# Altium project IndoorLocalizationUnit.PrjPcb
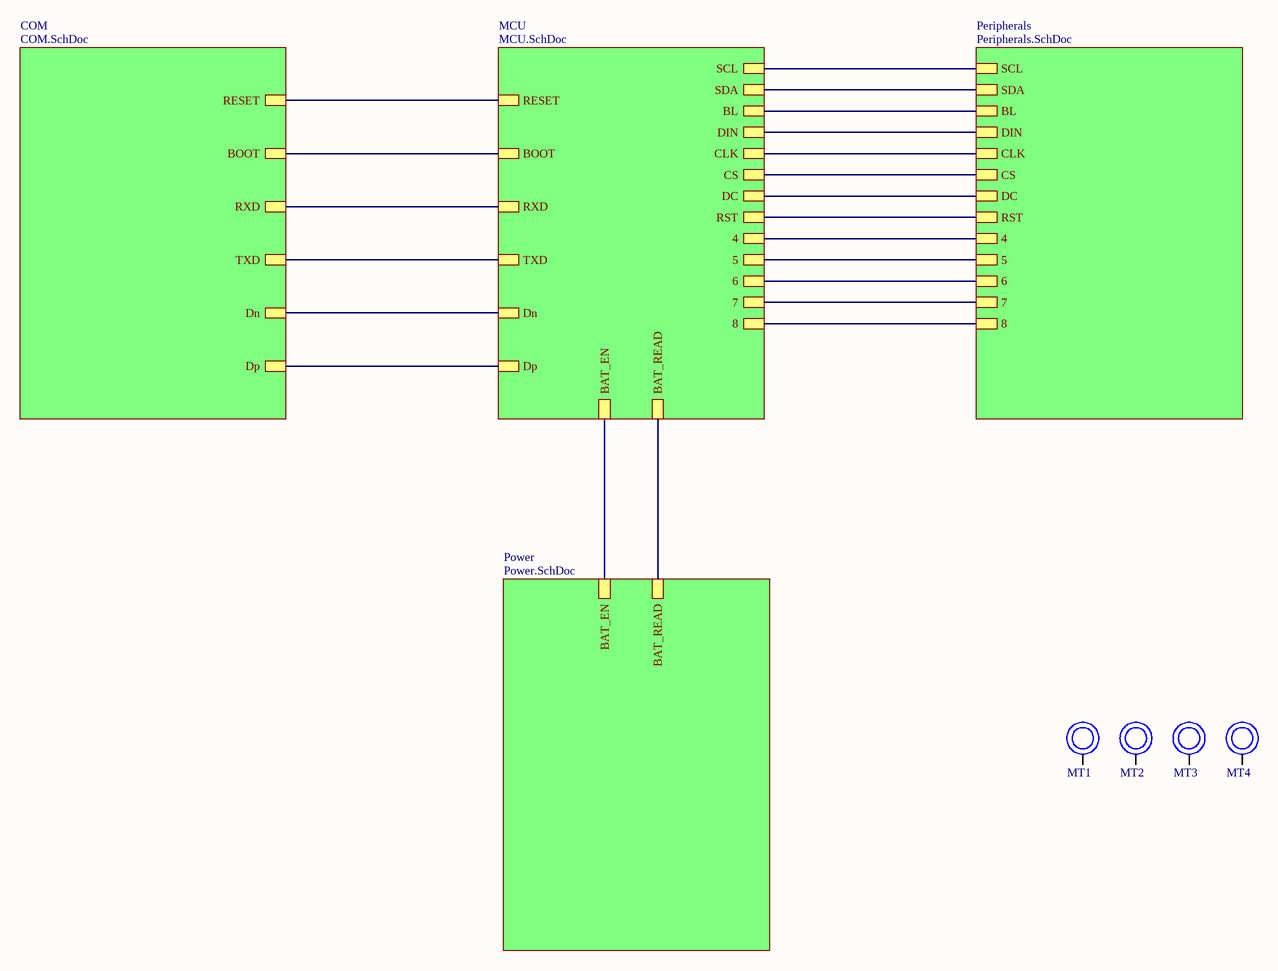
[diagram p0: Main.SchDoc]
5 sheets, 75 parts. Net scope: hierarchical (ports join the sheet entries above them; power ports are global).
Board file: PCB5.PcbDoc
Sheets:
  Main.SchDoc
    MCU = MCU.SchDoc
    Power = Power.SchDoc
    Peripherals = Peripherals.SchDoc
    COM = COM.SchDoc

## Sheet Main.SchDoc
size A3; SheetNumber: 1; SheetTotal: 5

### Parts
MT1  Mounting  [Mounting]  (value not drawn)
MT2  Mounting  [Mounting]  (value not drawn)
MT3  Mounting  [Mounting]  (value not drawn)
MT4  Mounting  [Mounting]  (value not drawn)

### Sub-sheets
COM = COM.SchDoc: RXD, TXD, Dn, Dp, BOOT, RESET
MCU = MCU.SchDoc: TXD, RXD, DC, RST, CS, SCL, SDA, BL, DIN, CLK, BAT_EN, BAT_READ, Dn, Dp, 7, 4, 6, 8, 5, RESET, BOOT
Peripherals = Peripherals.SchDoc: SCL, SDA, BL, DIN, CLK, CS, DC, RST, 4, 8, 5, 7, 6
Power = Power.SchDoc: BAT_EN, BAT_READ

### Nets
B_n: sheet MCU/Dp, sheet COM/Dp
B_p: sheet MCU/Dn, sheet COM/Dn
NetC3_B: sheet MCU/RESET, sheet COM/RESET
NetC5_A: sheet MCU/BOOT, sheet COM/BOOT
NetC11_B: sheet MCU/4, sheet Peripherals/4
NetC12_B: sheet MCU/5, sheet Peripherals/5
NetC13_B: sheet MCU/6, sheet Peripherals/6
NetC14_B: sheet MCU/7, sheet Peripherals/7
NetC15_B: sheet MCU/8, sheet Peripherals/8
NetDS1_3: sheet MCU/DIN, sheet Peripherals/DIN
NetDS1_4: sheet MCU/CLK, sheet Peripherals/CLK
NetDS1_5: sheet MCU/CS, sheet Peripherals/CS
NetDS1_6: sheet MCU/DC, sheet Peripherals/DC
NetDS1_7: sheet MCU/RST, sheet Peripherals/RST
NetDS1_8: sheet MCU/BL, sheet Peripherals/BL
NetQ1_2: sheet MCU/BAT_EN, sheet Power/BAT_EN
NetR18_A: sheet MCU/BAT_READ, sheet Power/BAT_READ
NetU1_36: sheet MCU/RXD, sheet COM/RXD
NetU1_37: sheet MCU/TXD, sheet COM/TXD
NetU1_38: sheet MCU/SDA, sheet Peripherals/SDA
NetU1_39: sheet MCU/SCL, sheet Peripherals/SCL

Not connected (* = marked no-connect by the designer): MT1 A; MT2 A; MT3 A; MT4 A

## Sheet MCU.SchDoc
size A3; SheetNumber: 2; SheetTotal: 5
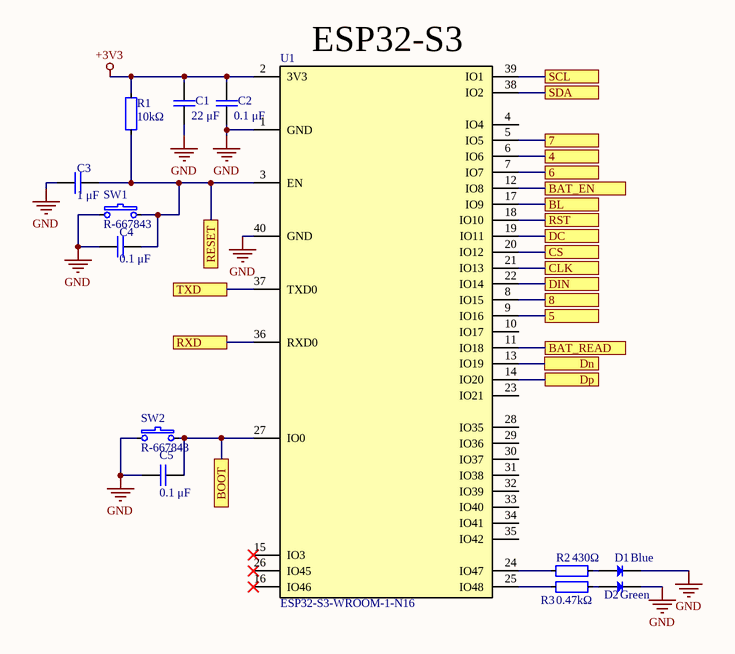
[diagram p1: MCU.SchDoc]

### Parts
C1  22 μF  [Capacitor 0603]
C2  0.1 μF  [Capacitor 0603]
C3  1 μF  [Capacitor 0603]
C4  0.1 μF  [Capacitor 0603]
C5  0.1 μF  [Capacitor 0603]
D1  Blue  [LED 0603]
D2  Green  [LED 0603]
R1  10kΩ  [Resistor 0603]
R2  430Ω  [Resistor 0603]
R3  0.47kΩ  [Resistor 0603]
SW1  R-667843  [R-667843]
SW2  R-667843  [R-667843]
U1  ESP32-S3-WROOM-1-N16  [ESP32-C3-WROOM-1]

### Ports
4 (see Main[5B], Peripherals[3C]), 5 (see Main[5B], Peripherals[4C]), 6 (see Main[5B], Peripherals[5C]), 7 (see Main[5B], Peripherals[4C]), 8 (see Main[5B], Peripherals[3C]), BAT_EN (see Main[4B], Power[5C]), BAT_READ (see Main[4B], Power[5C]), BL (see Main[5A], Peripherals[6B]), BOOT (see Main[4B], COM[8B]), CLK (see Main[5B], Peripherals[6B]), CS (see Main[5B], Peripherals[6B]), DC (see Main[5B], Peripherals[6B]), DIN (see Main[5A], Peripherals[6B]), Dn (see Main[4B], COM[5C]), Dp (see Main[4B], COM[5C]), RESET (see Main[4A], COM[8B]), RST (see Main[5B], Peripherals[6B]), RXD (see Main[4B], COM[6B]), SCL (see Main[5A], Peripherals[2B]), SDA (see Main[5A], Peripherals[2B]), TXD (see Main[4B], COM[6B])

### Nets
+3V3: C1.B C2.B R1.A U1.2(3V3)
GND: C1.A C2.A C3.A C4.A C5.B D1.B D2.B SW1.A SW2.B U1.1(GND) U1.40(GND)
B_n: U1.14(IO20) ; port Dp
B_p: U1.13(IO19) ; port Dn
NetC3_B: C3.B C4.B R1.B SW1.B U1.3(EN) ; port RESET
NetC5_A: C5.A SW2.A U1.27(IO0) ; port BOOT
NetC11_B: U1.6(IO6) ; port 4
NetC12_B: U1.9(IO16) ; port 5
NetC13_B: U1.7(IO7) ; port 6
NetC14_B: U1.5(IO5) ; port 7
NetC15_B: U1.8(IO15) ; port 8
NetD1_A: D1.A R2.B
NetD2_A: D2.A R3.B
NetDS1_3: U1.22(IO14) ; port DIN
NetDS1_4: U1.21(IO13) ; port CLK
NetDS1_5: U1.20(IO12) ; port CS
NetDS1_6: U1.19(IO11) ; port DC
NetDS1_7: U1.18(IO10) ; port RST
NetDS1_8: U1.17(IO9) ; port BL
NetQ1_2: U1.12(IO8) ; port BAT_EN
NetR2_A: R2.A U1.24(IO47)
NetR3_A: R3.A U1.25(IO48)
NetR18_A: U1.11(IO18) ; port BAT_READ
NetU1_36: U1.36(RXD0) ; port RXD
NetU1_37: U1.37(TXD0) ; port TXD
NetU1_38: U1.38(IO2) ; port SDA
NetU1_39: U1.39(IO1) ; port SCL

Not connected (* = marked no-connect by the designer): U1 4(IO4) 10(IO17) 15(IO3)* 16(IO46)* 23(IO21) 26(IO45)* 28(IO35) 29(IO36) 30(IO37) 31(IO38) 32(IO39) 33(IO40) 34(IO41) 35(IO42)

### Notes on the sheet
- (near U1) ESP32-S3

### Library data of the parts
C1 = 22 μF 0603: Capacitor 22 μF; Manufacturer: Murata Electronics; Manufacturer Part Number: GRM188R60G226MEA0D; Supplier 1: Digikey; Supplier Part Number 1: 490-5526-1-ND; Value: 22 μF
C2 C4 C5 = 0.1 μF 0603: Capacitor 0.1 μF; Manufacturer: Samsung Electro-Mechanics; Manufacturer Part Number: CL10B104KB8NNWC; Supplier 1: Digikey; Supplier Part Number 1: 1276-1935-1-ND; Value: 0.1 μF
C3 = 1 μF 0603: Capacitor 1 μF; Manufacturer: Samsung Electro-Mechanics; Manufacturer Part Number: CL10A105KA8NNNC; Supplier 1: Digikey; Supplier Part Number 1: 1276-1102-1-ND; Value: 1 μF
D1 = D.Blue: Diode Blue; Manufacturer: Lite-On Inc.; Manufacturer Part Number: LTST-C193TBKT-5A; Supplier 1: Digikey; Supplier Part Number 1: 160-1827-1-ND; Value: Blue
D2 = D.Green: Diode Green; Manufacturer: Lumex Opto/Components Inc.; Manufacturer Part Number: SML-LXFT0603GC-TR; Supplier 1: Digikey; Supplier Part Number 1: 67-SML-LXFT0603GC-TRCT-ND; Value: Green
R1 = 10 kΩ 0603: Resistor 10000 Ω; Manufacturer: Stackpole Electronics Inc; Manufacturer Part Number: RMCF0603FT10K0; Supplier 1: Digikey; Supplier Part Number 1: RMCF0603FT10K0CT-ND; Value: 10kΩ
R2 = 430 Ω 0603: Resistor 430 Ω; Manufacturer: Stackpole Electronics Inc; Manufacturer Part Number: RMCF0603JT430R; Supplier 1: Digikey; Supplier Part Number 1: RMCF0603JT430RCT-ND; Value: 430Ω
R3 = 0.47 kΩ 0603: Resistor 470 Ω; Manufacturer: Stackpole Electronics Inc; Manufacturer Part Number: RMCF0603FT470R; Supplier 1: Digikey; Supplier Part Number 1: RMCF0603FT470RCT-ND; Value: 0.47kΩ
SW1 SW2 = R-667843: SWITCH TACTILE SPST-NO 0.05A 12V; Manufacturer: Mitsumi Electric Company Ltd; Supplier 1: Digikey; Supplier Part Number 1: 2508-R-667843CT-ND; Manufacturer Part Number: R-667843
U1 = ESP32-S3-WROOM-1-N16: RF TXRX MODULE BT PCB TRACE SMD; Manufacturer: Espressif Systems; Supplier 1: Digikey; Supplier Part Number 1: 1965-ESP32-S3-WROOM-1-N16CT-ND; Manufacturer Part Number: ESP32-S3-WROOM-1-N16

## Sheet Power.SchDoc
size A3; SheetNumber: 3; SheetTotal: 5
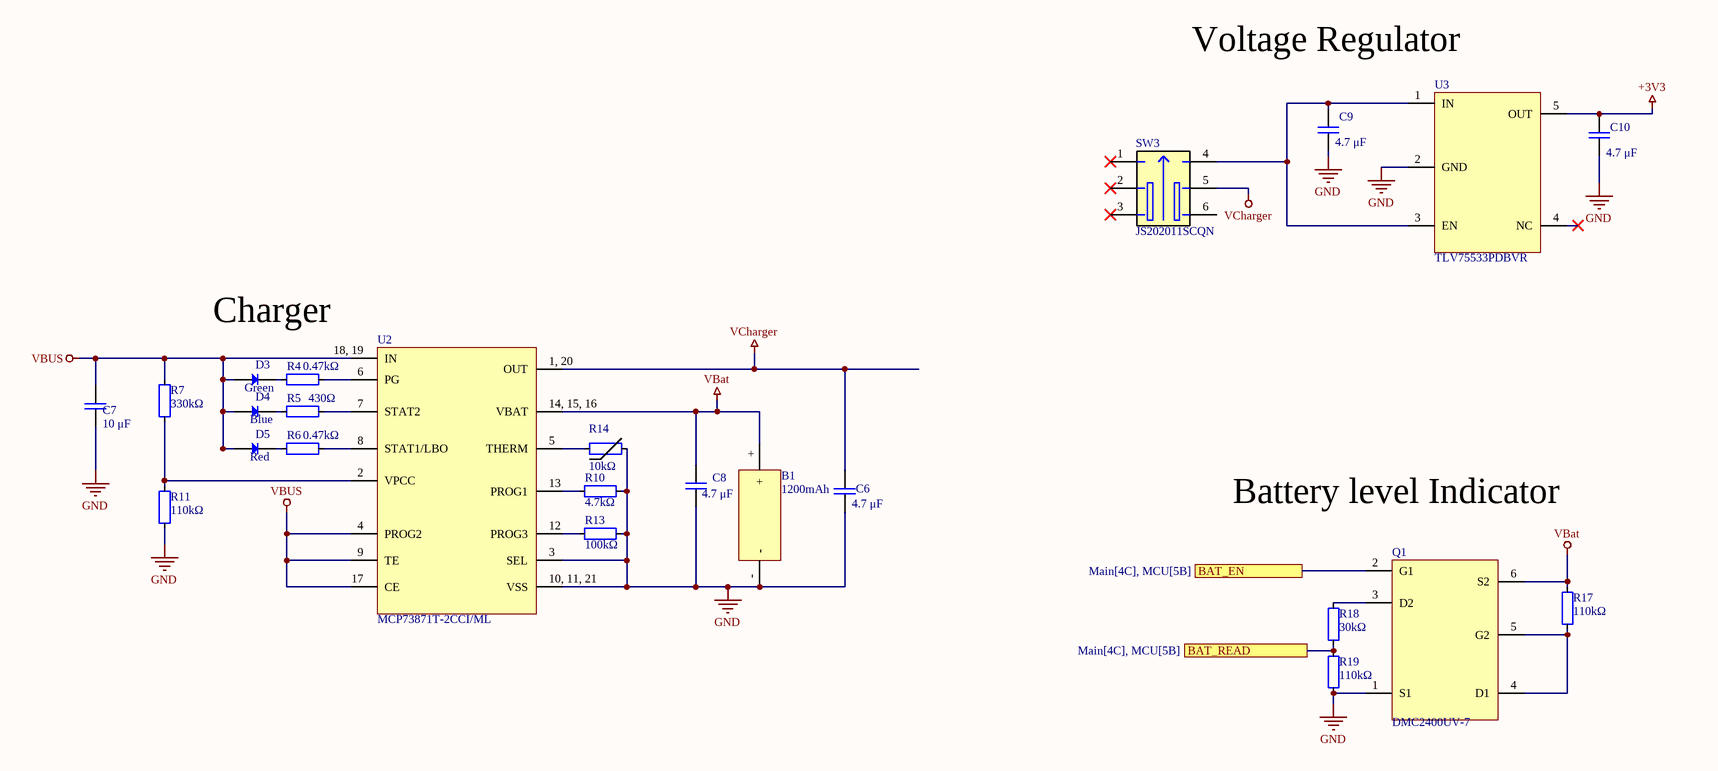
[diagram p2: Power.SchDoc]

### Parts
B1  1200mAh  [battery]
C6  4.7 μF  [Capacitor 0603]
C7  10 μF  [Capacitor 0603]
C8  4.7 μF  [Capacitor 0603]
C9  4.7 μF  [Capacitor 0603]
C10  4.7 μF  [Capacitor 0603]
D3  Green  [LED 0603]
D4  Blue  [LED 0603]
D5  Red  [LED 0603]
Q1  DMC2400UV-7  [MOSFET N/P-CH]
R4  0.47kΩ  [Resistor 0603]
R5  430Ω  [Resistor 0603]
R6  0.47kΩ  [Resistor 0603]
R7  330kΩ  [Resistor 0603]
R10  4.7kΩ  [Resistor 0603]
R11  110kΩ  [Resistor 0603]
R13  100kΩ  [Resistor 0603]
R14  10kΩ  [Thermistor 0603]
R17  110kΩ  [Resistor 0603]
R18  30kΩ  [Resistor 0603]
R19  110kΩ  [Resistor 0603]
SW3  JS202011SCQN  [JS202011SCQN]
U2  MCP73871T-2CCI/ML  [MCP73871]
U3  TLV75533PDBVR  [TLV75533PDBVR]

### Ports
BAT_EN (see Main[4C], MCU[5B]), BAT_READ (see Main[4C], MCU[5B])

### Nets
+3V3: C10.A U3.5(OUT)
GND: B1.- C6.A C7.A C8.B C9.A C10.B Q1.1(S1) R10.B R11.A R13.B R14.B R19.A U2.3(SEL) U2.10,_11,_21(VSS) U3.2(GND)
VBat: B1.+ C8.A Q1.6(S2) R17.A U2.14,_15,_16(VBAT)
VBUS: C7.B D3.A D4.A D5.A R7.B U2.4(PROG2) U2.9(TE) U2.17(CE) U2.18,_19(IN)
VCharger: C6.B SW3.5 U2.1,_20(OUT)
NetC9_B: C9.B SW3.4 U3.1(IN) U3.3(EN)
NetD3_B: D3.B R4.A
NetD4_B: D4.B R5.A
NetD5_B: D5.B R6.A
NetQ1_2: Q1.2(G1) ; port BAT_EN
NetQ1_3: Q1.3(D2) R18.B
NetQ1_4: Q1.4(D1) Q1.5(G2) R17.B
NetR4_B: R4.B U2.6(PG)
NetR5_B: R5.B U2.7(STAT2)
NetR6_B: R6.B U2.8(STAT1/LBO)
NetR7_A: R7.A R11.B U2.2(VPCC)
NetR10_A: R10.A U2.13(PROG1)
NetR13_A: R13.A U2.12(PROG3)
NetR14_A: R14.A U2.5(THERM)
NetR18_A: R18.A R19.B ; port BAT_READ

Not connected (* = marked no-connect by the designer): SW3 1* 2* 3* 6; U3 4(NC)*

### Notes on the sheet
- Voltage Regulator
- Charger
- Battery level Indicator

### Library data of the parts
B1 = Battery: Lipobatteri - 103040 - 1.200 mAh; Manufacturer: batterikungen; Manufacturer Part Number: 103040; Supplier 1: Batterikungen; Supplier Part Number 1: 827-016; Value: 1200mAh
C6 C8-C10 = 4,7 μF 0603: Capacitor 4.7 μF; Manufacturer: Samsung Electro-Mechanics; Manufacturer Part Number: CL10A475KP8NNNC; Supplier 1: Digikey; Supplier Part Number 1: 1276-1044-1-ND; Value: 4.7 μF
C7 = 10 μF 0603: Capacitor 10 μF; Manufacturer: Samsung Electro-Mechanics; Manufacturer Part Number: CL10A106MQ8NNNC; Supplier 1: Digikey; Supplier Part Number 1: 1276-1119-1-ND; Value: 10 μF
D3 = D.Green: as D2 on sheet MCU; Supplier 1: Digikey; Supplier Part Number 1: 67-SML-LXFT0603GC-TRCT-ND; Value: Green
D4 = D.Blue: as D1 on sheet MCU; Supplier 1: Digikey; Supplier Part Number 1: 160-1827-1-ND; Value: Blue
D5 = D.Red: Diode Red; Manufacturer: Lite-On Inc.; Manufacturer Part Number: LTST-C190KRKT; Supplier 1: Digikey; Supplier Part Number 1: 160-1436-1-ND; Value: Red
Q1 = DMC2400UV-7: MOSFET N/P-CH 20V SOT563; Manufacturer: Diodes Incorporated; Supplier 1: Digikey; Supplier Part Number 1: DMC2400UV-7DICT-ND; Manufacturer Part Number: DMC2400UV-7
R4 R6 = 0.47 kΩ 0603: as R3 on sheet MCU; Supplier 1: Digikey; Supplier Part Number 1: RMCF0603FT470RCT-ND; Value: 0.47kΩ
R5 = 430 Ω 0603: as R2 on sheet MCU; Supplier 1: Digikey; Supplier Part Number 1: RMCF0603JT430RCT-ND; Value: 430Ω
R7 = 330 kΩ 0603: Resistor 330000 Ω; Manufacturer: YAGEO; Manufacturer Part Number: RC0603JR-07330KL; Supplier 1: Digikey; Supplier Part Number 1: 311-330KGRCT-ND; Value: 330kΩ
R10 = 4.7 kΩ 0603: Resistor 4700 Ω; Manufacturer: Stackpole Electronics Inc; Manufacturer Part Number: RMCF0603FT4K70; Supplier 1: Digikey; Supplier Part Number 1: RMCF0603FT4K70CT-ND; Value: 4.7kΩ
R11 R17 R19 = 110 kΩ 0603: Resistor 110000 Ω; Manufacturer: Stackpole Electronics Inc; Manufacturer Part Number: RMCF0603FT110K; Supplier 1: Digikey; Supplier Part Number 1: RMCF0603FT110KCT-ND; Value: 110kΩ
R13 = 100 kΩ 0603: Resistor 100000 Ω; Manufacturer: Stackpole Electronics Inc; Manufacturer Part Number: RMCF0603FT100K; Supplier 1: Digikey; Supplier Part Number 1: RMCF0603FT100KCT-ND; Value: 100kΩ
R14 = NTC 10 KΩ 0603: Thermistor 10000 Ω; Manufacturer: Panasonic Electronic Components; Manufacturer Part Number: ERT-J1VR103J; Supplier 1: Digikey; Supplier Part Number 1: P10547CT-ND; Value: 10kΩ
R18 = 30 kΩ 0603: Resistor 30000 Ω; Manufacturer: YAGEO; Manufacturer Part Number: RC0603FR-0730KL; Supplier 1: Digikey; Supplier Part Number 1: 311-30.0KHRCT-ND; Value: 30kΩ
SW3 = JS202011SCQN: SWITCH SLIDE DPDT 300MA 6V; Manufacturer: C&K; Supplier 1: Digikey; Supplier Part Number 1: 401-2002-1-ND; Manufacturer Part Number: JS202011SCQN
U2 = MCP73871: IC BATT CHG LI-ION 1CELL 20QFN; Manufacturer: Microchip Technology; Supplier 1: Digikey; Supplier Part Number 1: MCP73871T-2CCI/MLDKR-ND; Manufacturer Part Number: MCP73871T-2CCI/ML
U3 = TLV75533PDBVR: IC REG LINEAR 3.3V 500MA SOT23-5; Manufacturer: Texas Instruments; Supplier 1: Digikey; Supplier Part Number 1: 296-50411-1-ND; Manufacturer Part Number: TLV75533PDBVR

## Sheet Peripherals.SchDoc
size A3; SheetNumber: 4; SheetTotal: 5
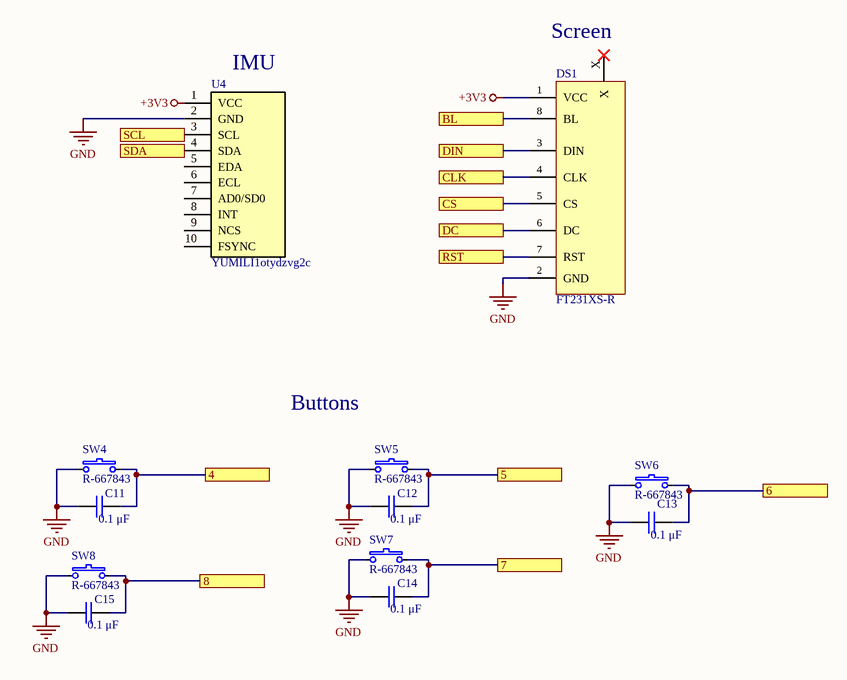
[diagram p3: Peripherals.SchDoc]

### Parts
C11  0.1 μF  [Capacitor 0603]
C12  0.1 μF  [Capacitor 0603]
C13  0.1 μF  [Capacitor 0603]
C14  0.1 μF  [Capacitor 0603]
C15  0.1 μF  [Capacitor 0603]
DS1  FT231XS-R  [Screen]
SW4  R-667843  [R-667843]
SW5  R-667843  [R-667843]
SW6  R-667843  [R-667843]
SW7  R-667843  [R-667843]
SW8  R-667843  [R-667843]
U4  YUMILI1otydzvg2c  [GY-9250]

### Ports
4 (see Main[5B], MCU[5B]), 5 (see Main[5B], MCU[5B]), 6 (see Main[5B], MCU[5B]), 7 (see Main[5B], MCU[5B]), 8 (see Main[5B], MCU[5B]), BL (see Main[5A], MCU[5B]), CLK (see Main[5B], MCU[5B]), CS (see Main[5B], MCU[5B]), DC (see Main[5B], MCU[5B]), DIN (see Main[5A], MCU[5B]), RST (see Main[5B], MCU[5B]), SCL (see Main[5A], MCU[5B]), SDA (see Main[5A], MCU[5B])

### Nets
+3V3: DS1.1(VCC) U4.1(VCC)
GND: C11.A C12.A C13.A C14.A C15.A DS1.2(GND) SW4.A SW5.A SW6.A SW7.A SW8.A U4.2(GND)
NetC11_B: C11.B SW4.B ; port 4
NetC12_B: C12.B SW5.B ; port 5
NetC13_B: C13.B SW6.B ; port 6
NetC14_B: C14.B SW7.B ; port 7
NetC15_B: C15.B SW8.B ; port 8
NetDS1_3: DS1.3(DIN) ; port DIN
NetDS1_4: DS1.4(CLK) ; port CLK
NetDS1_5: DS1.5(CS) ; port CS
NetDS1_6: DS1.6(DC) ; port DC
NetDS1_7: DS1.7(RST) ; port RST
NetDS1_8: DS1.8(BL) ; port BL
NetU1_38: U4.4(SDA) ; port SDA
NetU1_39: U4.3(SCL) ; port SCL

Not connected (* = marked no-connect by the designer): DS1 X*; U4 5(EDA) 6(ECL) 7(AD0/SD0) 8(INT) 9(NCS) 10(FSYNC)

### Notes on the sheet
- (near DS1) Screen
- (near U4) IMU
- (near SW5) Buttons

### Library data of the parts
C11-C15 = 0.1 μF 0603: as C2 on sheet MCU; Supplier 1: Digikey; Supplier Part Number 1: 1276-1935-1-ND; Value: 0.1 μF
DS1 = LCD-screen: 240×320, General 2.4inch LCD Display Module, 65K RGB; Manufacturer: FTDI, Future Technology Devices International Ltd; Supplier 1: Waveshare; Supplier Part Number 1: 768-1129-1-ND; Manufacturer Part Number: FT231XS-R
SW4-SW8 = R-667843: as SW1 on sheet MCU; Supplier 1: Digikey; Supplier Part Number 1: 2508-R-667843CT-ND; Manufacturer Part Number: R-667843
U4 = GY-9250: YUMILI Gyroskopmodul MPU-9250 GY-9250 9-axel 16-bitars; Supplier 1: Amazon; Supplier Part Number 1: B09XZQNQBV; Manufacturer: YUMILI; Manufacturer Part Number: YUMILI1otydzvg2c

## Sheet COM.SchDoc
size A3; SheetNumber: 5; SheetTotal: 5
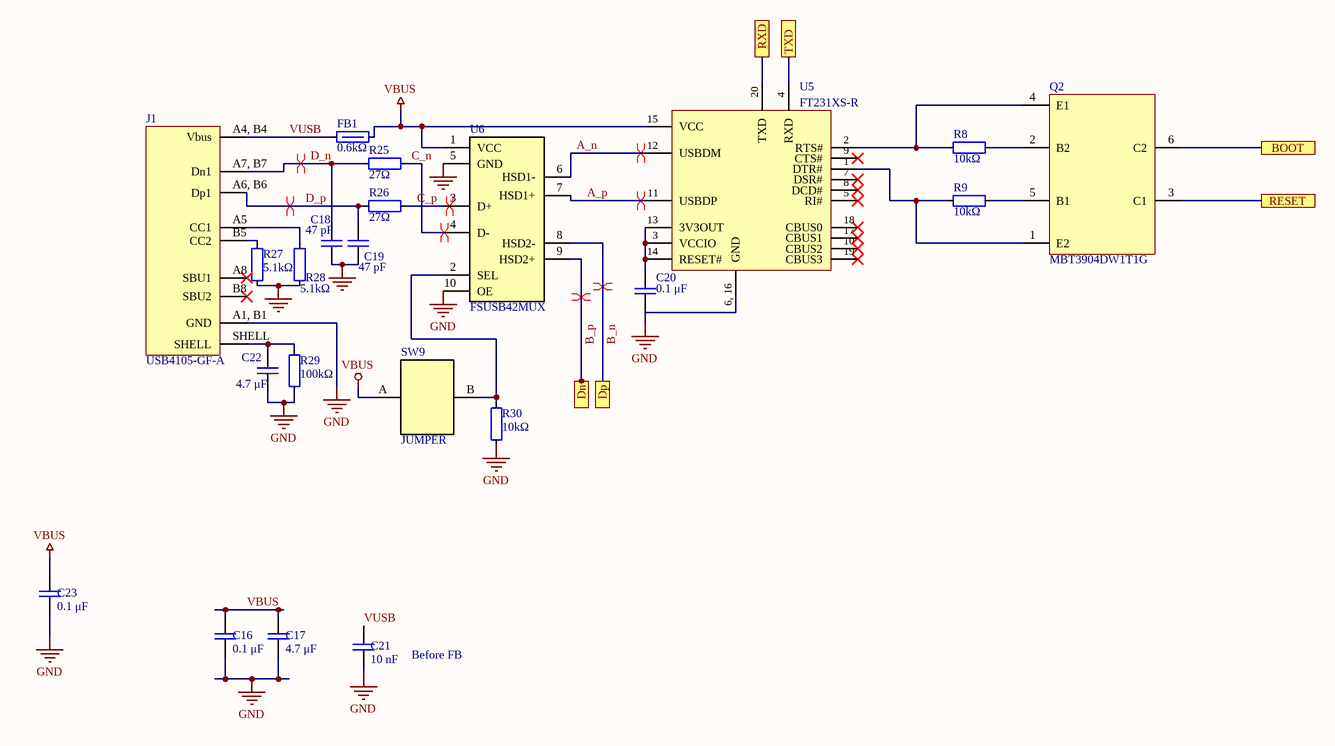
[diagram p4: COM.SchDoc]

### Parts
C16  0.1 μF  [Capacitor 0603]
C17  4.7 μF  [Capacitor 0603]
C18  47 pF  [Capacitor 0603]
C19  47 pF  [Capacitor 0603]
C20  0.1 μF  [Capacitor 0603]
C21  10 nF  [Capacitor 0603]
C22  4.7 μF  [Capacitor 0603]
C23  0.1 μF  [Capacitor 0603]
FB1  0.6kΩ  [Ferrite Bead 0603]
J1  USB4105-GF-A  [USB4105-GF-A]
Q2  MBT3904DW1T1G  [2NPN transistor]
R8  10kΩ  [Resistor 0603]
R9  10kΩ  [Resistor 0603]
R25  27Ω  [Resistor 0603]
R26  27Ω  [Resistor 0603]
R27  5.1kΩ  [Resistor 0603]
R28  5.1kΩ  [Resistor 0603]
R29  100kΩ  [Resistor 0603]
R30  10kΩ  [Resistor 0603]
SW9  JUMPER  [Jumper]
U5  FT231XS-R  [FT231XS-R]
U6  FSUSB42MUX  [FSUSB42MUX]

### Ports
BOOT (see Main[3B], MCU[4C]), Dn (see Main[3B], MCU[5B]), Dp (see Main[3B], MCU[5B]), RESET (see Main[3A], MCU[4B]), RXD (see Main[3B], MCU[4B]), TXD (see Main[3B], MCU[4B])

### Nets
GND: C16.A C17.A C18.A C19.A C20.A C21.A C22.A C23.A J1.A1,_B1(GND) R27.A R28.A R29.A R30.B U5.6,_16(GND) U6.5(GND) U6.10(OE)
VBUS: C16.B C17.B C23.B FB1.B SW9.A U5.15(VCC) U6.1(VCC)
A_n: U5.12(USBDM) U6.6(HSD1-)
A_p: U5.11(USBDP) U6.7(HSD1+)
B_n: U6.8(HSD2-) ; port Dp
B_p: U6.9(HSD2+) ; port Dn
C_n: R25.B U6.4(D-)
C_p: R26.B U6.3(D+)
D_n: C18.B J1.A7,_B7(Dn1) R25.A
D_p: C19.B J1.A6,_B6(Dp1) R26.A
VUSB: C21.B FB1.A J1.A4,_B4(Vbus)
NetC3_B: Q2.3(C1) ; port RESET
NetC5_A: Q2.6(C2) ; port BOOT
NetC20_B: C20.B U5.3(VCCIO) U5.13(3V3OUT) U5.14(RESET#)
NetC22_B: C22.B J1.SHELL R29.B
NetJ1_A5: J1.A5(CC1) R28.B
NetJ1_B5: J1.B5(CC2) R27.B
NetQ2_1: Q2.1(E2) R9.A U5.1(DTR#)
NetQ2_2: Q2.2(B2) R8.B
NetQ2_4: Q2.4(E1) R8.A U5.2(RTS#)
NetQ2_5: Q2.5(B1) R9.B
NetR30_A: R30.A SW9.B U6.2(SEL)
NetU1_36: U5.20(TXD) ; port RXD
NetU1_37: U5.4(RXD) ; port TXD

Not connected (* = marked no-connect by the designer): J1 A8(SBU1)* B8(SBU2)*; U5 5(RI#)* 7(DSR#)* 8(DCD#)* 9(CTS#)* 10(CBUS2)* 17(CBUS1)* 18(CBUS0)* 19(CBUS3)*

### Layout directives
differential pair: A_n, A_p, B_n, B_p, C_n, C_p, D_n, D_p

### Notes on the sheet
- (near C21) Before FB

### Library data of the parts
C16 C20 C23 = 0.1 μF 0603: as C2 on sheet MCU; Supplier 1: Digikey; Supplier Part Number 1: 1276-1935-1-ND; Value: 0.1 μF
C17 C22 = 4,7 μF 0603: as C6 on sheet Power; Supplier 1: Digikey; Supplier Part Number 1: 1276-1044-1-ND; Value: 4.7 μF
C18 C19 = 47 pF 0603: Capacitor 47 pF; Manufacturer: Walsin Technology Corporation; Manufacturer Part Number: 0603N470J500CT; Supplier 1: Digikey; Supplier Part Number 1: 1292-1528-1-ND; Value: 47 pF
C21 = 10 nF 0603: Capacitor 10 nF; Manufacturer: Samsung Electro-Mechanics; Manufacturer Part Number: CL10B103KB8NNNC; Supplier 1: Digikey; Supplier Part Number 1: 1276-1009-1-ND; Value: 10 nF
FB1 = FB 0.6 kΩ 0603: Ferrite Bead 600 Ω; Manufacturer: Murata Electronics; Manufacturer Part Number: BLM18AG601SN1D; Supplier 1: Digikey; Supplier Part Number 1: 490-1014-1-ND; Value: 0.6kΩ
J1 = USB4105-GF-A: CONN RCPT TYPE C 6P SMD RA; Manufacturer: GCT; Supplier 1: Digikey; Supplier Part Number 1: 2073-USB4105-GF-ACT-ND; Manufacturer Part Number: USB4105-GF-A
Q2 = MBT3904DW1T1G: TRANS 2NPN 40V 0.2A SC88/SC70-6; Manufacturer: onsemi; Supplier 1: Digikey; Supplier Part Number 1: MBT3904DW1T1GOSCT-ND; Manufacturer Part Number: MBT3904DW1T1G
R8 R9 R30 = 10 kΩ 0603: as R1 on sheet MCU; Supplier 1: Digikey; Supplier Part Number 1: RMCF0603FT10K0CT-ND; Value: 10kΩ
R25 R26 = 27 Ω 0603: Resistor 27 Ω; Manufacturer: Stackpole Electronics Inc; Manufacturer Part Number: RMCF0603FT27R0; Supplier 1: Digikey; Supplier Part Number 1: RMCF0603FT27R0CT-ND; Value: 27Ω
R27 R28 = 5.1 kΩ 0603: Resistor 5100 Ω; Manufacturer: Stackpole Electronics IncStackpole Electronics Inc; Manufacturer Part Number: RMCF0603FT5K10; Supplier 1: Digikey; Supplier Part Number 1: RMCF0603FT5K10CT-ND; Value: 5.1kΩ
R29 = 100 kΩ 0603: as R13 on sheet Power; Supplier 1: Digikey; Supplier Part Number 1: RMCF0603FT100KCT-ND; Value: 100kΩ
U5 = FT231XS-R_1: IC USB SERIAL FULL UART 20SSOP; Manufacturer: FTDI, Future Technology Devices International Ltd; Supplier 1: Digikey; Supplier Part Number 1: 768-1129-1-ND; Manufacturer Part Number: FT231XS-R
U6 = FSUSB42MUX: IC USB SWITCH DPDT 10MSOP; Manufacturer: onsemi; Supplier 1: Digikey; Supplier Part Number 1: FSUSB42MUXCT-ND; Manufacturer Part Number: FSUSB42MUX

## Nets that join several sheets
+3V3: MCU (C1.B C2.B R1.A U1.2), Power (C10.A U3.5), Peripherals (DS1.1 U4.1)
GND: MCU (11 pins), Power (15 pins), Peripherals (12 pins), COM (16 pins)
VBUS: Power (9 pins), COM (7 pins)
B_n: MCU (U1.14), COM (U6.8)
B_p: MCU (U1.13), COM (U6.9)
NetC3_B: MCU (5 pins), COM (Q2.3)
NetC5_A: MCU (C5.A SW2.A U1.27), COM (Q2.6)
NetC11_B: MCU (U1.6), Peripherals (C11.B SW4.B)
NetC12_B: MCU (U1.9), Peripherals (C12.B SW5.B)
NetC13_B: MCU (U1.7), Peripherals (C13.B SW6.B)
NetC14_B: MCU (U1.5), Peripherals (C14.B SW7.B)
NetC15_B: MCU (U1.8), Peripherals (C15.B SW8.B)
NetDS1_3: MCU (U1.22), Peripherals (DS1.3)
NetDS1_4: MCU (U1.21), Peripherals (DS1.4)
NetDS1_5: MCU (U1.20), Peripherals (DS1.5)
NetDS1_6: MCU (U1.19), Peripherals (DS1.6)
NetDS1_7: MCU (U1.18), Peripherals (DS1.7)
NetDS1_8: MCU (U1.17), Peripherals (DS1.8)
NetQ1_2: MCU (U1.12), Power (Q1.2)
NetR18_A: MCU (U1.11), Power (R18.A R19.B)
NetU1_36: MCU (U1.36), COM (U5.20)
NetU1_37: MCU (U1.37), COM (U5.4)
NetU1_38: MCU (U1.38), Peripherals (U4.4)
NetU1_39: MCU (U1.39), Peripherals (U4.3)